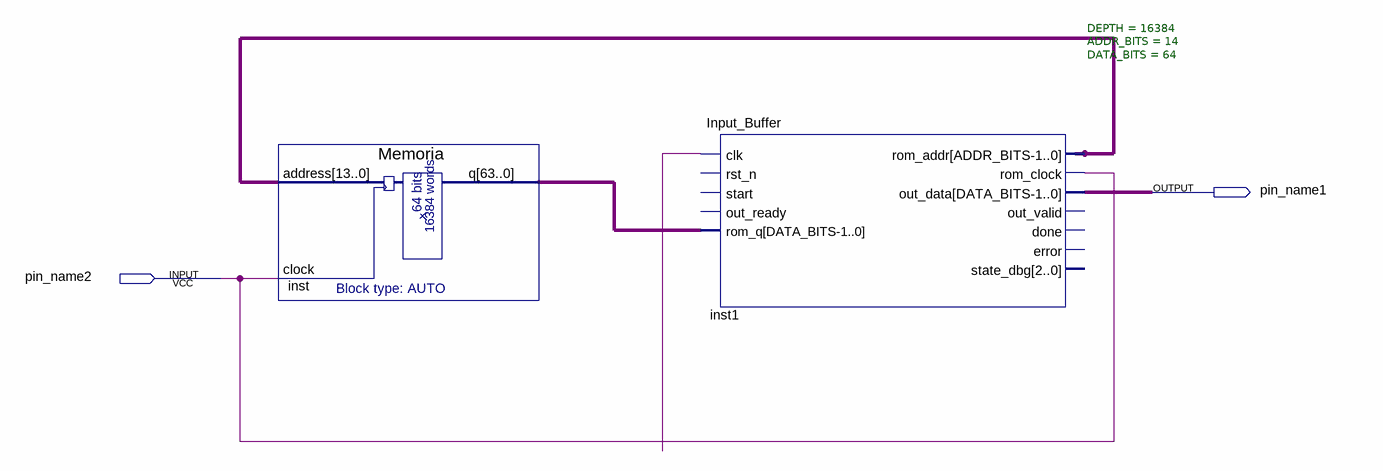
[diagram p0: schematic sheet]
// Quartus schematic TOP.bdf as structural Verilog: 2 symbols, 2 pins
module TOP (
  input  pin_name2,
  output pin_name1
);

  wire undriven;
  wire [13:0] inst1_rom_addr;
  wire [63:0] inst1_out_data, inst_q;

  Memoria inst (.address(inst1_rom_addr), .clock(pin_name2), .q(inst_q));
  Input_Buffer #(.DEPTH(16384), .ADDR_BITS(14), .DATA_BITS(64)) inst1 (
    .clk(undriven), .rom_q(inst_q), .rom_addr(inst1_rom_addr), .rom_clock(pin_name2),
    .out_data(inst1_out_data));  // open: rst_n, start, out_ready, out_valid, done, error, state_dbg
endmodule
